# EAGLE design ArduIMU328-v3 (EAGLE 6.2)
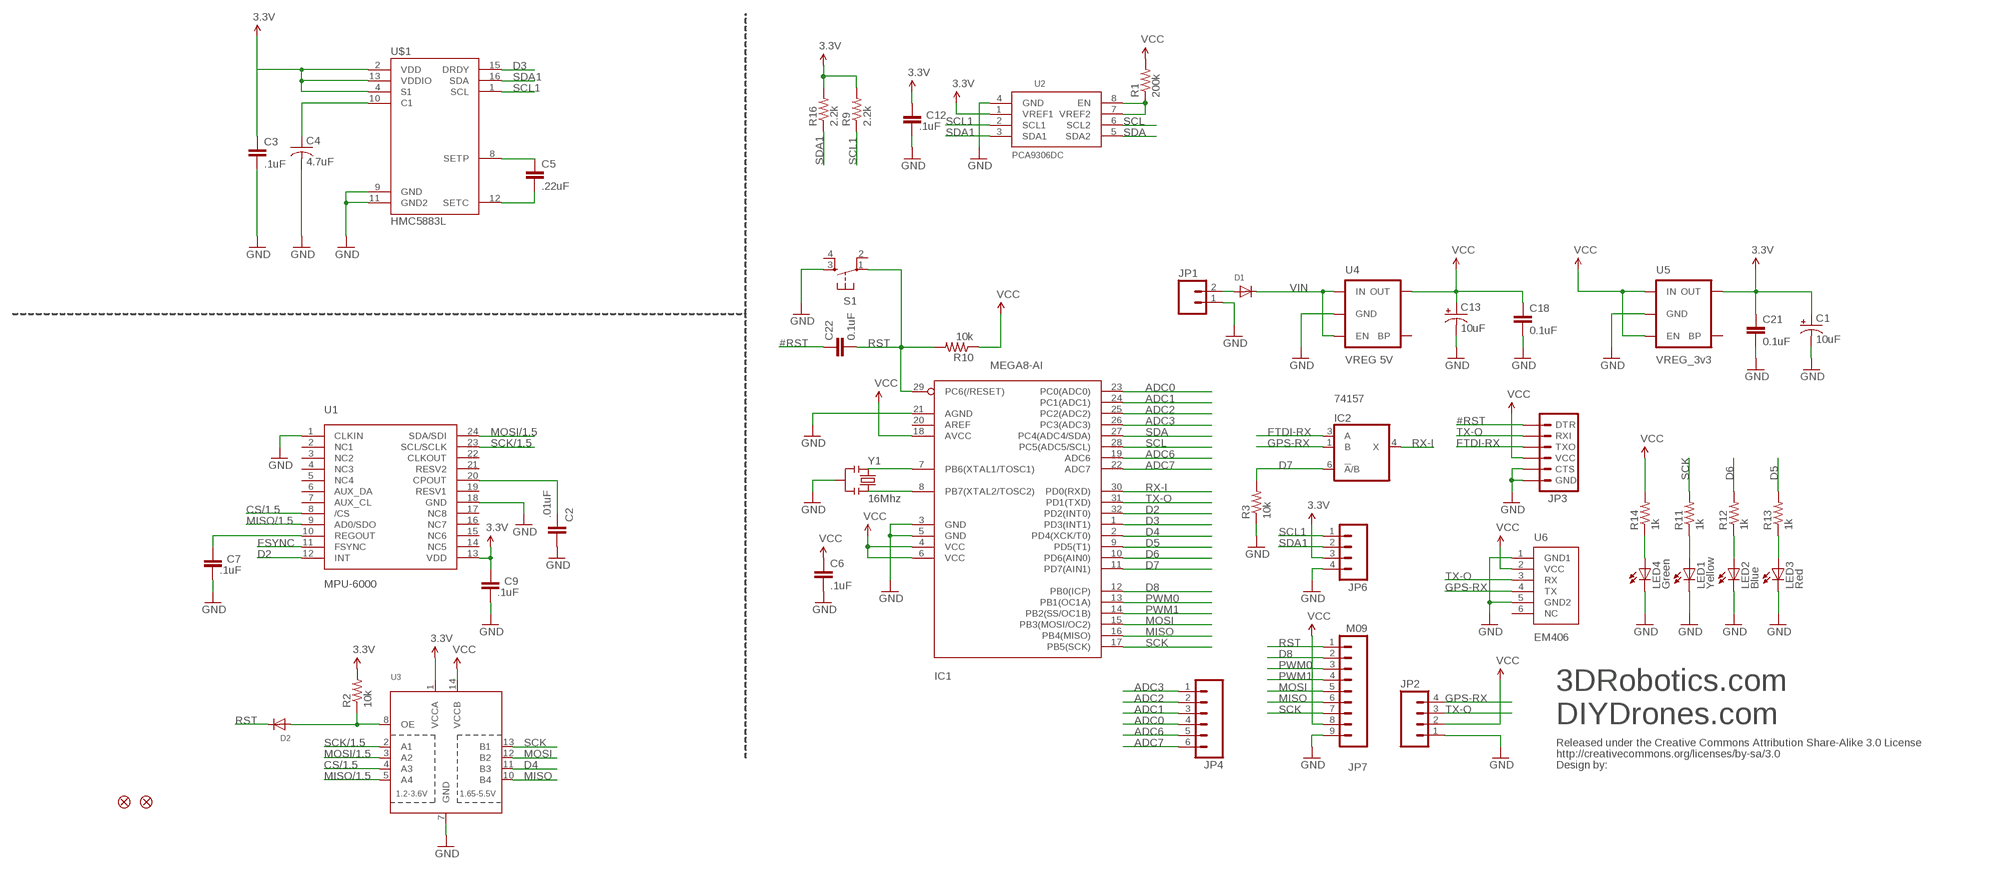
[diagram p0: schematic, sheet 1]

## Parts
C1  10uF  CAP_POL1206  [EIA3216]
C2  .01uF  C-EUC0402  [C0402]
C3  .1uF  CAP0402-CAP  [0402-CAP]
C4  4.7uF  C-USC1206  [C1206]
C5  .22uF  CAP0402-CAP  [0402-CAP]
C6  .1uF  CAP0402-CAP  [0402-CAP]
C7  .1uF  C-EUC0402  [C0402]
C9  .1uF  C-EUC0402  [C0402]
C12  .1uF  C-EUC0402  [C0402]
C13  10uF  CAP_POL1206  [EIA3216]
C18  0.1uF  CAP0402-CAP  [0402-CAP]
C21  0.1uF  CAP0402-CAP  [0402-CAP]
C22  0.1uF  CAP0402-CAP  [0402-CAP]
D1  DIODESOD-123  [SOD-123]
D2  DIODESOD-123  [SOD-123]
IC1  MEGA8-AI  [TQFP32-08]
IC2  74157  741G3157DBVR  [DBV_R-PDSO-G6]
JP1  M02PTH  [1X02]
JP2  M04PTH  [1X04]
JP3  ARDUINO_SERIAL_PROGRAMPTH  [1X06]
JP4  M06SIP  [1X06]
JP5  FIDUCIAL1X2  [FIDUCIAL-1X2]
JP6  M04PTH  [1X04]
JP7  M09  [1X09]
JP8  FIDUCIAL1X2  [FIDUCIAL-1X2]
LED1  Yellow  LED0603  [LED-0603]
LED2  Blue  LED0603  [LED-0603]
LED3  Red  LED0603  [LED-0603]
LED4  Green  LED0603  [LED-0603]
R1  200k  RESISTOR0402  [C0402]
R2  10k  RESISTOR0402-RES  [0402-RES]
R3  10k  RESISTOR0402-RES  [0402-RES]
R9  2.2k  RESISTOR0402  [C0402]
R10  10k  RESISTOR0402-RES  [0402-RES]
R11  1k  RESISTOR0402-RES  [0402-RES]
R12  1k  RESISTOR0402-RES  [0402-RES]
R13  1k  RESISTOR0402-RES  [0402-RES]
R14  1k  RESISTOR0402-RES  [0402-RES]
R16  2.2k  RESISTOR0402  [C0402]
S1  TAC_SWITCHSMD  [TACTILE_SWITCH_SMD]
U1  MPU-6000  MPU-3000  [QFN-24]
U2  PCA9306DC  [VSSOP8]
U3  TXB0104PWR  [TSSOP14]
U4  VREG 5V  V_REG_LDOSMD  [SOT23-5]
U5  VREG_3v3  V_REG_LDOSMD  [SOT23-5]
U6  EM406  [EM406]
U$1  HMC5883L  [LPCC16]
U$2  CREATIVE_COMMONS  [CREATIVE_COMMONS]
Y1  16Mhz  RESONATORSMD  [RESONATOR-SMD]

## Nets
3.3V: C1.A(+) C3.1 C9.2 C12.2 C21.1 JP6.3 R2.2 R9.2 R16.2 U1.13(VDD) U2.1(VREF1) U3.1(VCCA) U5.5(OUT) U$1.2(VDD) U$1.4(S1) U$1.13(VDDIO)
#RST: C22.1 JP3.1(DTR)
ADC0: IC1.23(PC0(ADC0)) JP4.4
ADC1: IC1.24(PC1(ADC1)) JP4.3
ADC2: IC1.25(PC2(ADC2)) JP4.2
ADC3: IC1.26(PC3(ADC3)) JP4.1
ADC6: IC1.19(ADC6) JP4.5
ADC7: IC1.22(ADC7) JP4.6
CS/1.5: U1.8(/CS) U3.4(A3)
D2: IC1.32(PD2(INT0)) U1.12(INT)
D3: IC1.1(PD3(INT1)) U$1.15(DRDY)
D4: IC1.2(PD4(XCK/T0)) U3.11(B3)
D5: IC1.9(PD5(T1)) R13.2
D6: IC1.10(PD6(AIN0)) R12.2
D7: IC1.11(PD7(AIN1)) IC2.6(!A!/B) R3.2
D8: IC1.12(PB0(ICP)) JP7.2
FSYNC: U1.11(FSYNC)
FTDI-RX: IC2.3(A) JP3.3(TXO)
GND: C1.C(-) C2.1 C3.2 C4.2 C6.2 C7.1 C9.1 C12.1 C13.C(-) C18.2 C21.2 IC1.3(GND) IC1.5(GND) IC1.21(AGND) JP1.1 JP2.1 JP3.5(CTS) JP3.6(GND) JP6.4 JP7.9 LED1.C LED2.C LED3.C LED4.C R3.1 S1.3 U1.1(CLKIN) U1.18(GND) U2.4(GND) U3.7(GND) U4.2(GND) U5.2(GND) U6.1(GND1) U6.5(GND2) U$1.9(GND) U$1.11(GND2) Y1.2
GPS-RX: IC2.1(B) JP2.4 U6.4(TX)
MISO: IC1.16(PB4(MISO)) JP7.6 U3.10(B4)
MISO/1.5: U1.9(AD0/SDO) U3.5(A4)
MOSI: IC1.15(PB3(MOSI/OC2)) JP7.5 U3.12(B2)
MOSI/1.5: U1.24(SDA/SDI) U3.3(A2)
N$1: R1.1 U2.7(VREF2) U2.8(EN)
N$2: C2.2 U1.20(CPOUT)
N$3: C7.2 U1.10(REGOUT)
N$4: C4.1 U$1.10(C1)
N$5: IC1.7(PB6(XTAL1/TOSC1)) Y1.1
N$6: C5.1 U$1.8(SETP)
N$7: IC1.8(PB7(XTAL2/TOSC2)) Y1.3
N$8: C5.2 U$1.12(SETC)
N$9: D2.A R2.1 U3.8(OE)
N$11: LED1.A R11.1
N$12: LED2.A R12.1
N$13: LED3.A R13.1
N$14: D1.A JP1.2
N$17: LED4.A R14.1
PWM0: IC1.13(PB1(OC1A)) JP7.3
PWM1: IC1.14(PB2(SS/OC1B)) JP7.4
RST: C22.2 D2.C IC1.29(PC6(/RESET)) JP7.1 R10.2 S1.1
RX-I: IC1.30(PD0(RXD)) IC2.4(X)
SCK: IC1.17(PB5(SCK)) JP7.7 R11.2 U3.13(B1)
SCK/1.5: U1.23(SCL/SCLK) U3.2(A1)
SCL: IC1.28(PC5(ADC5/SCL)) U2.6(SCL2)
SCL1: JP6.1 R9.1 U2.2(SCL1) U$1.1(SCL)
SDA: IC1.27(PC4(ADC4/SDA)) U2.5(SDA2)
SDA1: JP6.2 R16.1 U2.3(SDA1) U$1.16(SDA)
TX-O: IC1.31(PD1(TXD)) JP2.3 JP3.2(RXI) U6.3(RX)
VCC: C6.1 C13.A(+) C18.1 IC1.4(VCC) IC1.6(VCC) IC1.18(AVCC) JP2.2 JP3.4(VCC) JP7.8 R1.2 R10.1 R14.2 U3.14(VCCB) U4.5(OUT) U5.1(IN) U5.3(EN) U6.2(VCC)
VIN: D1.C U4.1(IN) U4.3(EN)
Unconnected: IC1.20(AREF) S1.2 S1.4 U1.2(NC1) U1.3(NC2) U1.4(NC3) U1.5(NC4) U1.6(AUX_DA) U1.7(AUX_CL) U1.14(NC5) U1.15(NC6) U1.16(NC7) U1.17(NC8) U1.19(RESV1) U1.21(RESV2) U1.22(CLKOUT) U4.4(BP) U5.4(BP) U6.6(NC)

## Notes on the sheet
- 3DRobotics.com
- DIYDrones.com

## Power pins joined to a net without a drawn wire
GND: IC2.2(GND)
VCC: IC2.5(VCC)

## Library data of the parts
C1 C13 = SparkFun:CAP_POL: Capacitor Polarized These are standard SMD and PTH capacitors. Normally 10uF, 47uF, and 100uF in electrolytic and tantalum varieties. Always verify the external diameter of the through hole cap, it varies with capacity, voltage, and manufacturer. The EIA devices should be standard.
C2 C7 C9 C12 = SmartPrj:C-EU: CAPACITOR, European symbol
C3 C5 C6 C18 C21 C22 = SparkFun:CAP: Capacitor Standard 0603 ceramic capacitor, and 0.1" leaded capacitor.
C4 = rcl:C-US: CAPACITOR, American symbol
D1 D2 = adafruit:DIODE: Diode SMADIODE - SMA Surface Mount Package 20V 1A Schottky Diode Digikey: 641-1014-6-ND DO-1N4148 - Through Hole Small Current Diode SOD-123 20V 1 A (.5mV Vf) Schottky Diode - Digikey: MBRX120TPMSCT-ND SOD-323 10V 570mA (.38mV Vf, 3ns) Schottky Diode - Digikey: ZLLS410CT-ND SOD-523 30V 30mA Schottky Diode (RB751S-40TE61) - Digikey: RB751S-40TE61CT-ND SOT23-R/W - SOT23 Package (R = Solder Paste/Reflow Ovens, W = Hand-Soldering) BAT54Film 40V 300mA - Digikey: 497-7162-1-ND
IC1 = atmel:MEGA8: MICROCONTROLLER 8 Kbytes FLASH, 1 kbytes SRAM, 512 bytes EEPROM, USART, 6-channel 10 bit ADC, 2-channel 8 bit ADC Pin compatible with Atmega48, ATMega88, ATMega168 Source: avr.lbr
IC2 = 74xx-little-de:74*1G3157: Single-Pole, Double-Throw Analog Switch Source: http://focus.ti.com/lit/ds/symlink/sn74lvc1g3157.pdf
JP1 = SparkFun:M02: Header 2 Standard 2-pin 0.1" header. Use with straight break away headers (SKU : PRT-00116), right angle break away headers (PRT-00553), swiss pins (PRT-00743), machine pins (PRT-00117), and female headers (PRT-00115). Molex polarized connector foot print use with SKU : PRT-08233 with associated crimp pins and housings.
JP2 JP6 = SparkFun:M04: Header 4 Standard 4-pin 0.1" header. Use with straight break away headers (SKU : PRT-00116), right angle break away headers (PRT-00553), swiss pins (PRT-00743), machine pins (PRT-00117), and female headers (PRT-00115). Molex polarized connector foot print use with SKU : PRT-08231 with associated crimp pins and housings.
JP3 = SparkFun:ARDUINO_SERIAL_PROGRAM
JP4 = SparkFun:M06: Header 6 Standard 6-pin 0.1" header. Use with straight break away headers (SKU : PRT-00116), right angle break away headers (PRT-00553), swiss pins (PRT-00743), machine pins (PRT-00117), and female headers (PRT-00115). Molex polarized connector foot print use with SKU : PRT-08094 with associated crimp pins and housings. NOTES ON THE VARIANTS LOCK and LOCK_LONGPADS... This footprint was designed to help hold the alignment of a through-hole component (i.e. 6-pin header) while soldering it into place. You may notice that each hole has been shifted either up or down by 0.005 of an inch from it's more standard position (which is a perfectly straight line). This slight alteration caused the pins (the squares in the middle) to touch the edges of the holes. Because they are alternating, it causes a "brace" to hold the component in place. 0.005 has proven to be the perfect amount of "off-center" position when using our standard breakaway headers. Although looks a little odd when you look at the bare footprint, once you have a header in there, the alteration is very hard to notice. Also, if you push a header all the way into place, it is covered up entirely on the bottom side. This idea of altering the position of holes to aid alignment will be further integrated into the Sparkfun Library for other footprints. It can help hold any component with 3 or more connection pins.
JP5 JP8 = SparkFun:FIDUCIAL: Fiducial Alignment Points Various fiducial points for machine vision alignment.
JP7 = SparkFun:M09: Header 9 Standard 9-pin 0.1" header. Use with straight break away headers (SKU : PRT-00116), right angle break away headers (PRT-00553), swiss pins (PRT-00743), machine pins (PRT-00117), and female headers (PRT-00115).
LED1-LED4 = DIYdrones3:LED: LEDs Standard schematic elements and footprints for 5mm, 3mm, 1206, and 0603 sized LEDs. 5mm - Spark Fun Electronics SKU : COM-00529 (and others)
R1 R9 R16 = DIYdrones3:RESISTOR: Resistor Basic schematic elements and footprints for 0603, 1206, and PTH 1/10th watt (small) resistors.
R2 R3 R10-R14 = SparkFun:RESISTOR: Resistor Basic schematic elements and footprints for 0603, 1206, and PTH 1/10th watt (small) resistors.
S1 = DIYdrones3:TAC_SWITCH: Momentary Switch Button commonly used for reset or general input. Spark Fun Electronics SKU : COM-00097
U1 = 3DRobotics_Master_Library:MPU-3000: Invensense MPU-3000 Motion Processing Unit The MPU-30X0 Motion Processing Unit (MPU?) is the world?s first motion processing solution with integrated 6-axis sensor fusion for smart phone applications. The MPU-30X0 has an embedded 3- axis gyroscope and Digital Motion Processor? (DMP) hardware accelerator engine with a secondary I 2 C port that interfaces to third party digital accelerometers to deliver a complete 6-axis sensor fusion output to its primary I 2 C port. This combines both linear and rotational motion into a single data stream for the application.; DATASHEET: http://invensense.com/mems/gyro/documents/PS-MPU-3000A-00_v2.6.pdf; LINK: http://www.invensense.com/mems/gyro/mpu3000.html; MFGPN: MPU-3000
U2 = DIYdrones_082610:PCA9306DC
U3 = adafruit:TXB0104PWR: 4-Bit Bi-Directional Level Shifter 1.2V-3.6V (VCCA) to 1.65V-5.5V (VCCB) bi-directional level shifter with auto direction sensing. Max data rate - VCCA 1.8V: 20Mbps (50ns), VCCA 3.3V: 100Mbps (10ns) Digikey: 296-21929-1-ND
U4 U5 = DIYdrones3:V_REG_LDO: Voltage Regulator LDO Standard 150mA LDO voltage regulator in SOT-23 layout. Micrel part MIC5205. BP (by-pass) pin is used to lower output noise with 470pF cap.
U6 = DIYdrones3:EM406: EM406 Connector Proven layout and schematic for EM406 connector. Spark Fun Electronics SKU : GPS-00579
U$1 = 3DRobotics:HMC5883L: Honeywell HMC5883L 3-axis digital compass IC Successor to the HMC5843.; DATASHEET: http://www.dsscircuits.com/images/datasheets/HMC5883L.pdf; LINK: http://parts.digikey.com/1/parts/2057013-ic-compass-3-axis-i2c-16lcc-smd-hmc5883l-tr.html; MFGPN: HMC5883L-TR
U$2 = SparkFun:CREATIVE_COMMONS
Y1 = DIYdrones3:RESONATOR: Resonator Small SMD resonator. This is the itty bitty 10/20MHz resonators with built in caps. CSTCE10M0G55 and CSTCE20M0V53. Footprint has been reviewed closely but hasn't been tested yet.

## Board
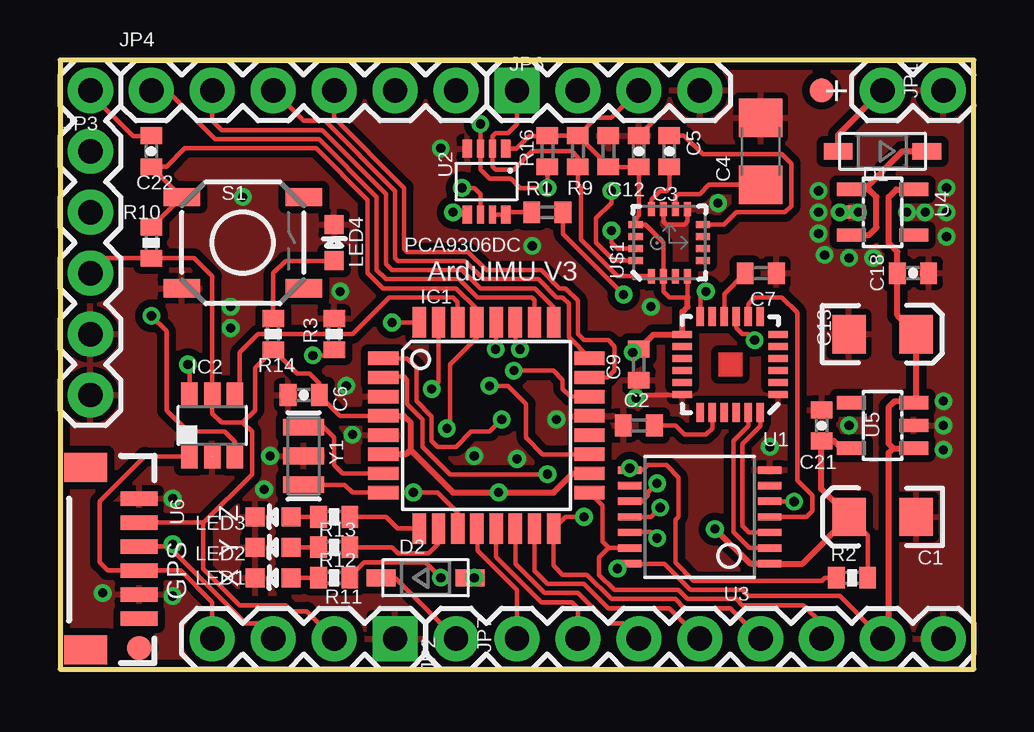
[diagram p1: board, top side]
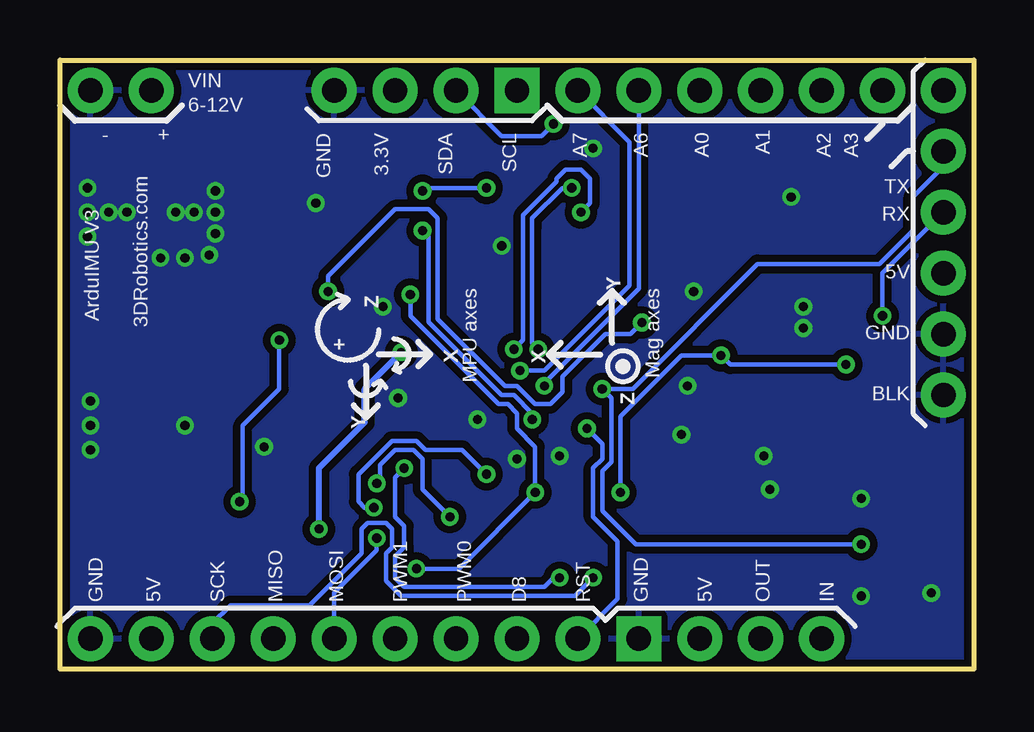
[diagram p2: board, bottom side, seen from below]

Size 38.1 x 25.4 mm. Coordinates in mm from the lower left corner, seen from the top.
Outline: 0,0 38.1,0 38.1,25.4 0,25.4 0,0
Copper layers (1*2+15*16): Top 0.035mm / dielectric 1.5mm / Route2 0.035mm / dielectric 0.15mm / Route15 0.035mm / dielectric 0.2mm / Bottom 0.035mm
Design rules: minimum track width 7mil, minimum drill 15mil, track to track 7mil, track to pad 7mil, pad to pad 7mil, via to via 7mil, smd to smd 0mil, copper to edge 10mil, drill to drill 8mil, minimum pad ring 7mil, minimum via ring 7mil, stop-mask expansion 4mil, vias tented up to drill 25mil, thermal gap 10mil

### Footprints (pad centres in the part's own frame; a part is rotated, then mirrored left to right if it is on the bottom)
EIA3216 = smd 1.4 x 1.6: A 1.4,0; C -1.4,0
C0402 = smd 0.7 x 0.9: 1 -0.65,0; 2 0.65,0
0402-CAP = smd 0.7 x 0.9: 1 -0.65,0; 2 0.65,0
C1206 = smd 1.6 x 1.8: 1 -1.4,0; 2 1.4,0
SOD-123 = smd 1.2 x 0.7: A 1.85,0; C -1.85,0
TQFP32-08 = smd 1.27 x 0.559: 1 -4.293,2.8; 2 -4.293,2; 3 -4.293,1.2; 4 -4.293,0.4; 5 -4.293,-0.4; 6 -4.293,-1.2; 7 -4.293,-2; 8 -4.293,-2.8; 17 4.293,-2.8; 18 4.293,-2; 19 4.293,-1.2; 20 4.293,-0.4; 21 4.293,0.4; 22 4.293,1.2; 23 4.293,2; 24 4.293,2.8 | smd 0.559 x 1.27: 9 -2.8,-4.293; 10 -2,-4.293; 11 -1.2,-4.293; 12 -0.4,-4.293; 13 0.4,-4.293; 14 1.2,-4.293; 15 2,-4.293; 16 2.8,-4.293; 25 2.8,4.293; 26 2,4.293; 27 1.2,4.293; 28 0.4,4.293; 29 -0.4,4.293; 30 -1.2,4.293; 31 -2,4.293; 32 -2.8,4.293
DBV_R-PDSO-G6 = smd 0.69 x 0.99: 1 -0.95,-1.29; 2 0,-1.29; 3 0.95,-1.29; 4 0.95,1.3; 5 0,1.3; 6 -0.95,1.3
1X02 = drill 1.016 pad 1.88: 1 0,0; 2 2.54,0
1X04 = drill 1.016 pad 1.88 square: 1 0,0 | drill 1.016 pad 1.88: 2 2.54,0; 3 5.08,0; 4 7.62,0
1X06 = drill 1.016 pad 1.88: 1 0,0; 2 2.54,0; 3 5.08,0; 4 7.62,0; 5 10.16,0; 6 12.7,0
FIDUCIAL-1X2 = smd 1 x 1: 1 0,0
1X09 = drill 1.016 pad 1.88: 1 0,0; 2 2.54,0; 3 5.08,0; 4 7.62,0; 5 10.16,0; 6 12.7,0; 7 15.24,0; 8 17.78,0; 9 20.32,0
LED-0603 = smd 0.8 x 0.8: A 0,-0.75; C 0,0.75
0402-RES = smd 0.7 x 0.9: 1 -0.65,0; 2 0.65,0
TACTILE_SWITCH_SMD = smd 1.524 x 0.762: 1 -2.54,1.905; 2 2.54,1.905; 3 -2.54,-1.905; 4 2.54,-1.905
QFN-24 = smd 0.8 x 0.3: 1 -2,1.25; 2 -2,0.75; 3 -2,0.25; 4 -2,-0.25; 5 -2,-0.75; 6 -2,-1.25; 13 2,-1.25; 14 2,-0.75; 15 2,-0.25; 16 2,0.25; 17 2,0.75; 18 2,1.25 | smd 0.3 x 0.8: 7 -1.25,-2; 8 -0.75,-2; 9 -0.25,-2; 10 0.25,-2; 11 0.75,-2; 12 1.25,-2; 19 1.25,2; 20 0.75,2; 21 0.25,2; 22 -0.25,2; 23 -0.75,2; 24 -1.25,2
VSSOP8 = smd 0.75 x 0.4: 1 -1.375,0.8; 4 -1.375,-0.8; 5 1.375,-0.8; 8 1.375,0.8 | smd 0.75 x 0.3: 2 -1.375,0.25; 3 -1.375,-0.25; 6 1.375,-0.25; 7 1.375,0.25
TSSOP14 = smd 0.305 x 0.991: 1 -1.95,-2.918; 2 -1.3,-2.918; 3 -0.65,-2.918; 4 0,-2.918; 5 0.65,-2.918; 6 1.3,-2.918; 7 1.95,-2.918; 8 1.95,2.918; 9 1.3,2.918; 10 0.65,2.918; 11 0,2.918; 12 -0.65,2.918; 13 -1.3,2.918; 14 -1.95,2.918
SOT23-5 = smd 0.55 x 1.2: 1 -0.95,-1.3; 2 0,-1.3; 3 0.95,-1.3; 4 0.95,1.3; 5 -0.95,1.3
EM406 = smd 0.6 x 1.55: 1 0,0; 2 1,0; 3 2,0; 4 3,0; 5 4,0; 6 5,0 | smd 1.2 x 1.8: P$1 -1.3,-2.225; P$2 6.3,-2.225
LPCC16 = smd 0.6 x 0.3: 1 -1.4,0.75; 2 -1.4,0.25; 3 -1.4,-0.25; 4 -1.4,-0.75; 9 1.4,-0.75; 10 1.4,-0.25; 11 1.4,0.25; 12 1.4,0.75 | smd 0.3 x 0.6: 5 -0.75,-1.4; 6 -0.25,-1.4; 7 0.25,-1.4; 8 0.75,-1.4; 13 0.75,1.4; 14 0.25,1.4; 15 -0.25,1.4; 16 -0.75,1.4
RESONATOR-SMD = smd 0.7 x 1.7: 1 -1.2,0; 2 0,0; 3 1.2,0

### Placement (x,y rotation side)
C1  34.29,6.35 180 top
C2  24.13,10.16 0 top
C3  24.13,21.59 90 top
C4  29.21,21.59 90 top
C5  25.4,21.59 270 top
C6  10.16,11.43 180 top
C7  29.21,16.51 180 top
C9  24.13,12.7 90 top
C12  22.86,21.59 270 top
C13  34.29,13.97 0 top
C18  35.56,16.51 0 top
C21  31.75,10.16 90 top
C22  3.81,21.59 270 top
D1  34.29,21.59 180 top
D2  15.24,3.81 0 top
IC1  17.78,10.16 0 top
IC2  6.35,10.16 0 top
JP1  36.83,24.13 180 top
JP2  13.97,1.27 180 top
JP3  1.27,24.13 270 top
JP4  3.81,24.13 0 top
JP5  3.3,0.89 0 top
JP6  19.05,24.13 0 top
JP7  16.51,1.27 0 top
JP8  31.75,24.13 0 top
LED1  8.89,3.81 90 top
LED2  8.89,5.08 90 top
LED3  8.89,6.35 90 top
LED4  11.43,17.78 0 top
R1  20.32,19.05 0 top
R2  33.02,3.81 0 top
R3  11.43,13.97 270 top
R9  21.59,21.59 90 top
R10  3.81,17.78 90 top
R11  11.43,3.81 0 top
R12  11.43,5.08 0 top
R13  11.43,6.35 0 top
R14  8.89,13.97 270 top
R16  20.32,21.59 90 top
S1  7.62,17.78 0 top
U1  27.94,12.7 180 top
U2  17.78,20.32 270 top
U3  26.67,6.35 90 top
U4  34.29,19.05 270 top
U5  34.29,10.16 90 top
U6  3.3,7.11 270 top
U$1  25.4,17.78 90 top
U$2  -11.94,27.81 0 top  (outside the outline)
Y1  10.16,8.89 270 top

### Tracks (layer width: path | path; a pad name or v marks a point on that pad's centre or on a via)
3.3V  (via drill 0.38)
  Top 0.178: U$1.4 26.16,16.37 26.16,15.49 25.4,15.49 25.15,15.74 U$1.2 25.15,17.78 24.4,18.53 U$1.13 24,18.79 24.13,18.92 C3.1 C12.2 22.86,20.97 R9.2 | R9.2 21.61,22.24 22.35,22.99 22.99,22.99 JP6.3 | R9.2 R16.2 20.3,22.23 19.56,22.23 19.03,21.7 U2.1 | 31.73,9.51 C21.1 | R2.2 33.67,5.57 C1.A
  Top 0.254: 26.16,15.49 26.16,15.11 25.94,14.89 U1.13 24.73,13.95 C9.2 23.99,13.21 v23.88,13.21 | v27.3,5.84 28.78,4.4 U3.1 30.94,4.4 C1.A 31.73,7.5 31.73,9.51 | U5.5 32.57,9.21 32.26,9.53 31.77,9.53 C21.1
  Bottom 0.254: v27.3,5.84 27.3,8.38 25.4,10.29 25.4,11.68 v23.88,13.21
#RST
  Top 0.178: JP3.1 1.27,24 3.05,22.23 3.79,22.23 C22.1
ADC0
  Top 0.178: IC1.23 22.83,12.16 23.11,12.45 23.11,13.46 22.86,13.72 21.84,13.72 21.59,13.97 21.59,15.37 21.08,15.88 20.83,15.88 20.07,16.64 17.78,16.64 17.02,17.4 14.48,17.4 14.35,17.53 14.35,20.07 11.43,22.99 JP4.4
ADC1
  Top 0.178: IC1.24 22.07,12.98 21.21,13.84 21.21,15.24 20.95,15.49 20.7,15.49 19.94,16.26 17.65,16.26 16.89,17.02 14.1,17.02 13.97,17.14 13.97,19.94 11.05,22.86 10.16,22.86 JP4.3
ADC2
  Top 0.178: IC1.25 20.58,15.11 19.81,15.88 17.53,15.88 16.76,16.64 13.84,16.64 13.59,16.89 13.59,19.81 10.92,22.48 6.73,22.48 6.35,22.86 JP4.2
ADC3
  Top 0.178: IC1.26 19.78,15.4 19.68,15.49 17.4,15.49 16.64,16.26 13.59,16.26 13.21,16.64 13.21,19.68 10.79,22.1 6.48,22.1 4.45,24.13 JP4.1
ADC6  (via drill 0.38)
  Top 0.178: IC1.19 20.12,8.96 19.43,9.65 19.43,11.05 18.67,11.81 v17.91,11.81
  Bottom 0.178: JP4.5 13.97,15.88 17.91,11.94 v17.91,11.81
ADC7  (via drill 0.38)
  Top 0.178: IC1.22 21.28,11.36 20.95,11.68 20.95,12.06 20.57,12.45 v18.92,12.45
  Bottom 0.178: JP4.6 14.35,21.97 14.35,16 17.91,12.45 v18.92,12.45
CS/1.5
  Top 0.178: U1.8 28.69,15.23 28.96,15.49 30.1,15.49 30.73,14.86 30.73,7.87 31.37,7.24 31.37,6.6 31.11,6.35 U3.4
D2  (via drill 0.38)
  Top 0.178: IC1.32 v13.84,14.45 | U1.12 26.69,15.51 v26.92,15.75
  Bottom 0.178: v26.92,15.75 26.92,16.38 24.13,19.18 22.73,19.18 22.35,18.8 22.35,14.61 19.56,11.81 19.05,11.81 18.29,11.05 17.65,11.05 17.14,11.56 17.14,12.19 15.37,13.97 14.33,13.97 v13.84,14.45
D3  (via drill 0.38)
  Top 0.178: IC1.1 14.47,12.96 14.86,12.57 14.86,11.18 15.49,10.54 15.49,9.53 15.75,9.27 16.51,9.27 17.14,9.91 17.91,9.91 v18.41,10.41 | v22.99,18.29 22.99,17.78 23.24,17.53 U$1.15
  Bottom 0.178: v18.41,10.41 18.41,10.67 19.18,11.43 19.68,11.43 22.73,14.48 22.73,18.03 v22.99,18.29
D4  (via drill 0.38)
  Top 0.178: IC1.2 13.46,12.19 14.35,12.19 14.48,12.06 14.48,11.05 15.11,10.41 15.11,9.27 16.26,8.13 v20.32,8.13 | U3.11 24.64,6.35 v25.02,6.73
  Bottom 0.178: v25.02,6.73 25.4,6.73 25.65,6.99 25.65,8.13 24.26,9.53 23.24,9.53 22.86,9.14 21.34,9.14 v20.32,8.13
D5
  Top 0.178: IC1.9 14.07,5.87 13.59,6.35 R13.2
D6
  Top 0.178: IC1.10 15.78,5.24 15.37,4.83 14.1,4.83 13.84,5.08 R12.2
D7  (via drill 0.38)
  Top 0.178: IC2.6 5.4,12.63 v5.33,12.7 | v10.54,13.08 11.19,13.08 R3.2 | IC1.11 16.58,6.53 15.75,7.37 v14.73,7.37
  Bottom 0.178: v5.33,12.7 10.16,12.7 v10.54,13.08 12.19,13.08 14.73,10.54 v14.73,7.37
D8
  Top 0.178: JP7.2 19.05,3.3 17.4,4.95 17.4,5.85 IC1.12
FTDI-RX  (via drill 0.38)
  Top 0.178: IC2.3 7.3,9.46 6.86,9.91 5.33,9.91 4.45,10.79 4.45,14.1 v3.81,14.73
  Bottom 0.178: v3.81,14.73 3.81,16.51 JP3.3
GND  (via drill 0.38)
  Top 0.178: U$1.9 26.15,18.66 26.04,18.54 25.27,18.54 25.15,18.67 25.15,18.8 U$1.11 | 24.38,11.43 25.92,11.43 U1.18 | C3.2 24.14,22.24 25.02,23.11
  other vias: 12.19,9.78 27.43,19.43 29.59,9.27 20.7,10.41 24,11.3 11.94,11.81 8.76,8.89 11.68,15.75 15.88,21.72 4.7,7.11 4.7,3.05 7.11,14.22 7.11,15.11 7.62,19.68 19.68,17.65 24.64,15.11 17.27,8.89 19.05,8.76 8.51,7.49 1.78,3.17 31.62,19.05 31.62,18.16 31.62,19.94 36.96,20.07 36.96,19.05 36.96,18.03 32.89,17.14 36.07,19.05 35.31,19.05 32.51,19.05 33.27,19.05 31.88,17.27 33.91,17.14 32.89,10.16 36.83,10.16 36.83,11.18 36.83,9.14
  pour Bottom (isolate 0.305): -0.25,25.4 39.12,25.4 39.12,0 -0.25,0
  pour Top (isolate 0.305): -0.25,25.4 39.12,25.4 39.12,0 -0.25,0
GPS-RX
  Top 0.178: JP2.4 6.35,2.79 5.03,4.11 U6.4 1.98,4.11 1.65,4.45 1.65,6.99 3.54,8.87 IC2.1
MISO  (via drill 0.38)
  Top 0.178: JP7.6 27.94,2.54 26.04,2.54 25.65,2.92 22.99,2.92 21.97,3.94 20.95,3.94 20.57,4.32 IC1.16 21.06,6.35 v21.84,6.35 | U3.10 24.27,7 24.51,7.24 24.51,7.37 v24.89,7.75
  Bottom 0.178: v21.84,6.35 22.99,7.49 22.99,8.76 23.37,9.14 24.13,9.14 24.77,8.51 24.77,7.87 v24.89,7.75
MISO/1.5  (via drill 0.38)
  Top 0.178: U1.9 28.19,14.23 28.45,13.97 28.7,13.97 v28.96,13.72 | U3.5 30.59,7 v30.61,6.99
  Bottom 0.178: v28.96,13.72 28.96,11.68 30.48,10.16 30.48,7.11 v30.61,6.99
MOSI  (via drill 0.38)
  Top 0.178: JP7.5 25.4,2.54 22.86,2.54 21.84,3.56 20.32,3.56 19.78,4.1 IC1.15 | v24.89,5.46 24.64,5.71 23.77,5.71 U3.12
  Bottom 0.178: v24.89,5.46 24.89,4.95 26.67,3.17 JP7.5
MOSI/1.5
  Top 0.178: U3.3 28.72,5.7 28.45,5.97 28.45,9.4 29.19,10.14 U1.24
N$1
  Top 0.178: R1.1 18.68,19.05 U2.8 U2.7
N$2
  Top 0.178: U1.20 27.19,10.04 26.92,9.78 26.04,9.78 25.65,10.16 C2.2
N$3
  Top 0.178: U1.10 27.69,15.64 C7.2
N$4
  Top 0.178: U$1.10 25.65,19.68 25.78,19.81 26.67,19.81 27.05,20.19 C4.1
N$5
  Top 0.178: Y1.1 10.99,10.09 11.43,9.65 11.43,8.51 11.78,8.16 IC1.7
N$6
  Top 0.178: U$1.8 27.67,18.53 28.19,19.05 30.23,19.05 30.48,19.3 30.48,21.08 30.1,21.46 26.8,21.46 26.02,22.24 C5.1
N$7
  Top 0.178: IC1.8 12.2,7.36 11.87,7.69 Y1.3
N$8
  Top 0.178: U$1.12 24.65,19.57 25.02,19.94 25.27,19.94 25.4,20.07 C5.2
N$9  (via drill 0.38)
  Top 0.178: D2.A v17.27,3.81 | v23.75,8.38 U3.8 24.3,8.3 24.51,8.51 25.27,8.51 25.78,8 25.78,6.35 25.65,6.22 25.65,4.45 26.42,3.68 31.75,3.68 31.88,3.81 R2.1
  Bottom 0.178: v17.27,3.81 17.53,3.81 17.91,3.43 23.75,3.43 24.13,3.81 24.13,4.7 23.75,5.08 23.75,5.97 24.13,6.35 24.13,8 v23.75,8.38
N$11
  Top 0.178: LED1.A R11.1
N$12
  Top 0.178: LED2.A R12.1
N$13
  Top 0.178: LED3.A R13.1
N$14
  Top 0.254: D1.A 32.44,22.28 JP1.2
N$17
  Top 0.178: R14.1 8.89,16.51 9.4,17.02 11.42,17.02 LED4.A
PWM0
  Top 0.178: IC1.13 18.18,4.68 20.07,2.79 21.34,2.79 21.59,2.54 JP7.3
PWM1
  Top 0.178: JP7.4 23.5,1.91 22.86,1.91 21.59,3.17 20.19,3.17 18.98,4.39 IC1.14
RST  (via drill 0.38)
  Top 0.178: R10.2 3.83,18.43 S1.1 3.83,20.94 C22.2 3.83,20.95 4.45,20.95 5.21,21.72 10.67,21.72 12.83,19.56 12.83,16.51 13.46,15.88 16.51,15.88 17.38,15.01 IC1.29 17.38,13.82 16.26,12.7 16.26,10.16 v16.13,10.03 | D2.C 13.97,3.81 JP7.1
  Bottom 0.178: v16.13,10.03 15.49,9.4 15.49,8.76 15.88,8.38 15.88,6.35 14.86,5.33 14.86,2.92 JP7.1
RX-I
  Top 0.178: IC1.30 16.58,15.3 16.38,15.49 13.72,15.49 12.19,13.97 8.26,13.97 7.49,13.21 7.49,11.65 IC2.4
SCK  (via drill 0.38)
  Top 0.178: 22.89,5.05 U3.13 | 22.89,5.05 22.86,5.05 22.48,4.67 22.48,3.94 23.11,3.3 25.78,3.3 26.16,2.92 28.19,2.92 28.45,2.67 30.99,2.67 31.75,1.91 JP7.7 | 22.89,5.05 22.61,5.33 22.61,6.83 IC1.17 | R11.2 12.05,3.83 12.68,4.45 15.24,4.45 v15.88,3.81
  Bottom 0.178: JP7.7 31.75,1.91 30.99,2.67 27.69,2.67 25.53,4.83 25.53,5.84 25.27,6.1 24.51,6.1 24.26,5.84 24.26,5.08 24.51,4.83 24.51,3.68 23.88,3.05 16.64,3.05 v15.88,3.81
SCK/1.5
  Top 0.178: U1.23 28.69,10.15 28.07,9.53 28.07,5.71 28.73,5.05 U3.2
SCL  (via drill 0.38)
  Top 0.178: IC1.28 18.18,13.44 v18.16,13.34 | v16.76,20.07 17.27,20.07 17.53,19.81 U2.6
  Bottom 0.178: v18.16,13.34 18.41,13.59 18.41,18.41 18.41,18.8 17.14,20.07 v16.76,20.07
SCL1
  Top 0.178: JP6.1 19.05,22.73 18.67,22.35 18.16,22.35 18.03,22.22 U2.2 18.03,20.96 18.16,20.83 18.92,20.83 19.68,21.59 21.34,21.59 21.59,21.34 R9.1 21.59,20.19 21.72,20.07 21.72,17.91 23.24,16.38 U$1.1
SDA  (via drill 0.38)
  Top 0.178: U2.5 16.47,18.96 v16.38,19.05 | IC1.27 18.98,13.53 v19.18,13.34
  Bottom 0.178: v19.18,13.34 18.8,13.72 18.8,18.92 17.4,20.32 17.4,20.45 17.02,20.83 16.38,20.83 16,20.45 16,19.43 v16.38,19.05
SDA1  (via drill 0.38)
  Top 0.178: U$1.16 23.1,17.03 22.35,17.78 22.35,18.8 22.99,19.43 v22.99,19.94 | 17.53,20.82 17.53,20.83 | 17.53,20.82 U2.3 17.53,22.6 v17.53,22.73 | 17.53,20.82 17.91,20.45 18.8,20.45 19.18,20.07 v20.32,20.07 R16.1
  Bottom 0.178: v17.53,22.73 18.03,22.23 19.68,22.23 JP6.2 | v20.32,20.07 22.86,20.07 v22.99,19.94
TX-O  (via drill 0.38)
  Top 0.178: 4.54,5.11 U6.3 | 4.54,5.11 7.75,1.91 8.26,1.91 JP2.3 | 4.54,5.11 4.6,5.11 v4.7,5.21 | IC1.31 15.78,11.97 v15.49,11.68
  Bottom 0.178: v4.7,5.21 14.1,5.21 15.49,6.6 15.49,8.26 15.11,8.64 15.11,11.3 v15.49,11.68 14.22,11.68 9.02,16.89 3.94,16.89 2.54,18.29 2.54,19.68 1.27,20.95 JP3.2
VCC  (via drill 0.38)
  Top 0.178: JP7.8 32.51,3.05 28.7,3.05 28.45,3.3 26.29,3.3 25.19,4.4 U3.14 23.54,4.4 v23.24,4.19 | IC1.4 11.68,10.56 C6.1 10.81,11.92 10.41,12.32 9.89,12.32 R14.2 8.13,12.56 8.13,10.79 7.62,10.29 | 7.62,10.29 6.73,10.29 6.35,10.67 IC2.5 6.35,16.38 5.59,17.14 3.83,17.14 R10.1 1.89,17.13 JP3.4 | U6.2 5.99,6.11 | 5.99,6.11 8,8.13 8,9.91 7.62,10.29 | JP2.2 10.29,2.41 9.65,2.41 9.4,2.67 7.49,2.67 5.97,4.19 5.97,6.1 5.99,6.11 | R1.2 20.97,18.15 v23.5,15.62
  Top 0.254: U4.5 34.86,20 34.54,19.68 34.54,17.77 34.91,17.4 C18.1 34.91,14.75 C13.A | 34.74,9.21 34.73,9.21 34.54,9.4 34.54,10.92 34.8,11.18 35.52,11.18 U5.3 35.69,11.21 C13.A | 34.74,9.21 U5.1 | JP7.8 34.54,1.52 34.54,9.02 34.74,9.21 | IC1.4 14.33,10.56 14.61,10.29 14.61,9.14 | IC1.6 14.42,8.96 14.61,9.14 | IC1.18 21.37,8.16 20.57,7.37 v18.29,7.37 16.38,7.37 14.61,9.14 | C13.A
  Bottom 0.178: v23.5,15.62 23.5,14.73 19.81,11.05 19.43,11.05 19.05,10.67 19.05,10.03 18.29,9.27 v18.29,7.37 21.46,4.19 v23.24,4.19
VIN
  Top 0.254: 33.53,20 33.72,20 34.04,19.68 34.04,18.41 33.72,18.1 U4.3 | 33.53,20 U4.1 | D1.C 35.12,21.59 33.53,20

### Text on the board
tPlace: + | ArduIMU V3 | Z | GPS | Y | X
bPlace: VIN | 6-12V | + | - | SCL | SDA | 3.3V | GND | A3 | A2 | A1 | A0 | A6 | A7 | 3DRobotics.com | TX | RX | ArduIMU V3 | 5V | Mag axes | Y | MPU axes | Z | GND | X | X | + | BLK | Z | Y | IN | OUT | 5V | GND | RST | D8 | PWM0 | PWM1 | MOSI | MISO | SCK | 5V | GND
tValues: Jordi Muñoz/3D Robotics